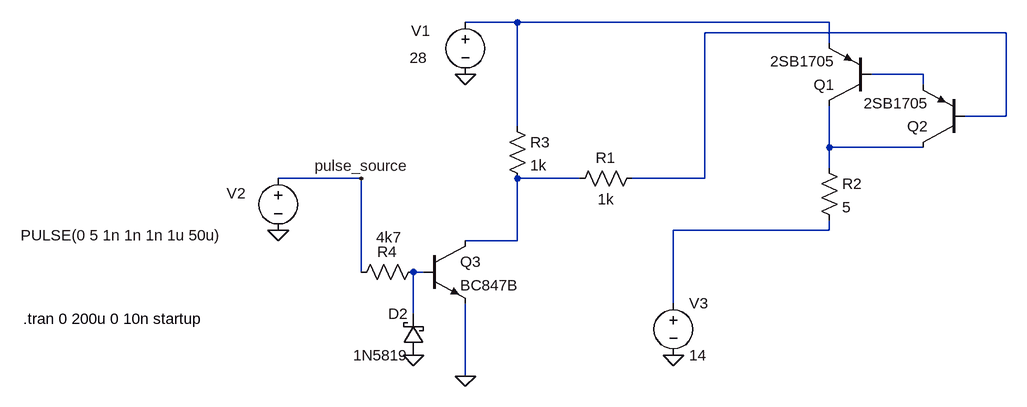
[diagram p0: schematic pnp_driver.asc]
pnp_driver.asc, the LTspice schematic file:
Version 4
SHEET 1 1708 680
WIRE -432 32 -512 32
WIRE 48 32 -432 32
WIRE 320 48 -144 48
WIRE 48 64 48 32
WIRE 192 112 112 112
WIRE 192 128 192 112
WIRE 320 176 320 48
WIRE 320 176 256 176
WIRE -432 192 -432 32
WIRE 48 224 48 160
WIRE 192 224 48 224
WIRE 48 256 48 224
WIRE -672 272 -800 272
WIRE -336 272 -432 272
WIRE -144 272 -144 48
WIRE -144 272 -256 272
WIRE 48 352 48 336
WIRE 48 352 -192 352
WIRE -432 368 -432 272
WIRE -432 368 -512 368
WIRE -672 416 -672 272
WIRE -576 416 -592 416
WIRE -192 464 -192 352
WIRE -592 480 -592 416
WIRE -512 576 -512 464
FLAG -800 352 0
FLAG -512 576 0
FLAG -672 272 pulse_source
FLAG -192 544 0
FLAG -592 544 0
FLAG -512 112 0
SYMBOL voltage -512 16 R0
WINDOW 0 -83 29 Left 2
WINDOW 3 -86 70 Left 2
WINDOW 123 0 0 Left 0
WINDOW 39 0 0 Left 0
SYMATTR InstName V1
SYMATTR Value 28
SYMBOL voltage -800 256 R0
WINDOW 0 -79 39 Left 2
WINDOW 3 -396 103 Left 2
WINDOW 123 0 0 Left 0
WINDOW 39 0 0 Left 0
SYMATTR InstName V2
SYMATTR Value PULSE(0 5 1n 1n 1n 1u 50u)
SYMBOL npn -576 368 R0
SYMATTR InstName Q3
SYMATTR Value BC847B
SYMBOL res -576 400 R90
WINDOW 0 0 56 VBottom 2
WINDOW 3 -53 54 VTop 2
SYMATTR InstName R4
SYMATTR Value 4k7
SYMBOL res 32 240 R0
SYMATTR InstName R2
SYMATTR Value 5
SYMBOL voltage -192 448 R0
WINDOW 123 0 0 Left 0
WINDOW 39 0 0 Left 0
SYMATTR InstName V3
SYMATTR Value 14
SYMBOL schottky -576 544 R180
WINDOW 0 24 64 Left 2
WINDOW 3 24 0 Left 2
SYMATTR InstName D2
SYMATTR Value 1N5819
SYMATTR Description Diode
SYMATTR Type diode
SYMBOL pnp 112 160 R180
SYMATTR InstName Q1
SYMATTR Value 2SB1705
SYMBOL pnp 256 224 R180
SYMATTR InstName Q2
SYMATTR Value 2SB1705
SYMBOL res -240 256 R90
WINDOW 0 0 56 VBottom 2
WINDOW 3 32 56 VTop 2
SYMATTR InstName R1
SYMATTR Value 1k
SYMBOL res -448 176 R0
SYMATTR InstName R3
SYMATTR Value 1k
TEXT -1192 488 Left 2 !.tran 0 200u 0 10n startup

The netlist it stands for:
* pnp_driver.asc
V1 N001 0 28
V2 pulse_source 0 PULSE(0 5 1n 1n 1n 1u 50u)
Q3 N005 N007 0 0 BC847B
R4 N007 pulse_source 4k7
R2 N004 N006 5
V3 N006 0 14
D2 0 N007 1N5819
Q1 N004 N003 N001 0 2SB1705
Q2 N004 N002 N003 0 2SB1705
R1 N002 N005 1k
R3 N001 N005 1k
.model D D
.lib standard.dio
.model NPN NPN
.model PNP PNP
.lib standard.bjt
.tran 0 200u 0 10n startup
.backanno
.end